# Altium schematic sheet Power Supply.SchDoc: 电动汽车电池管理系统
size A4; Address1: 先进成图技术赛道国赛试题; Address2: 陈大勇; Address3: 000000000000000000; Address4: DZ001; SheetNumber: 3; SheetTotal: 4
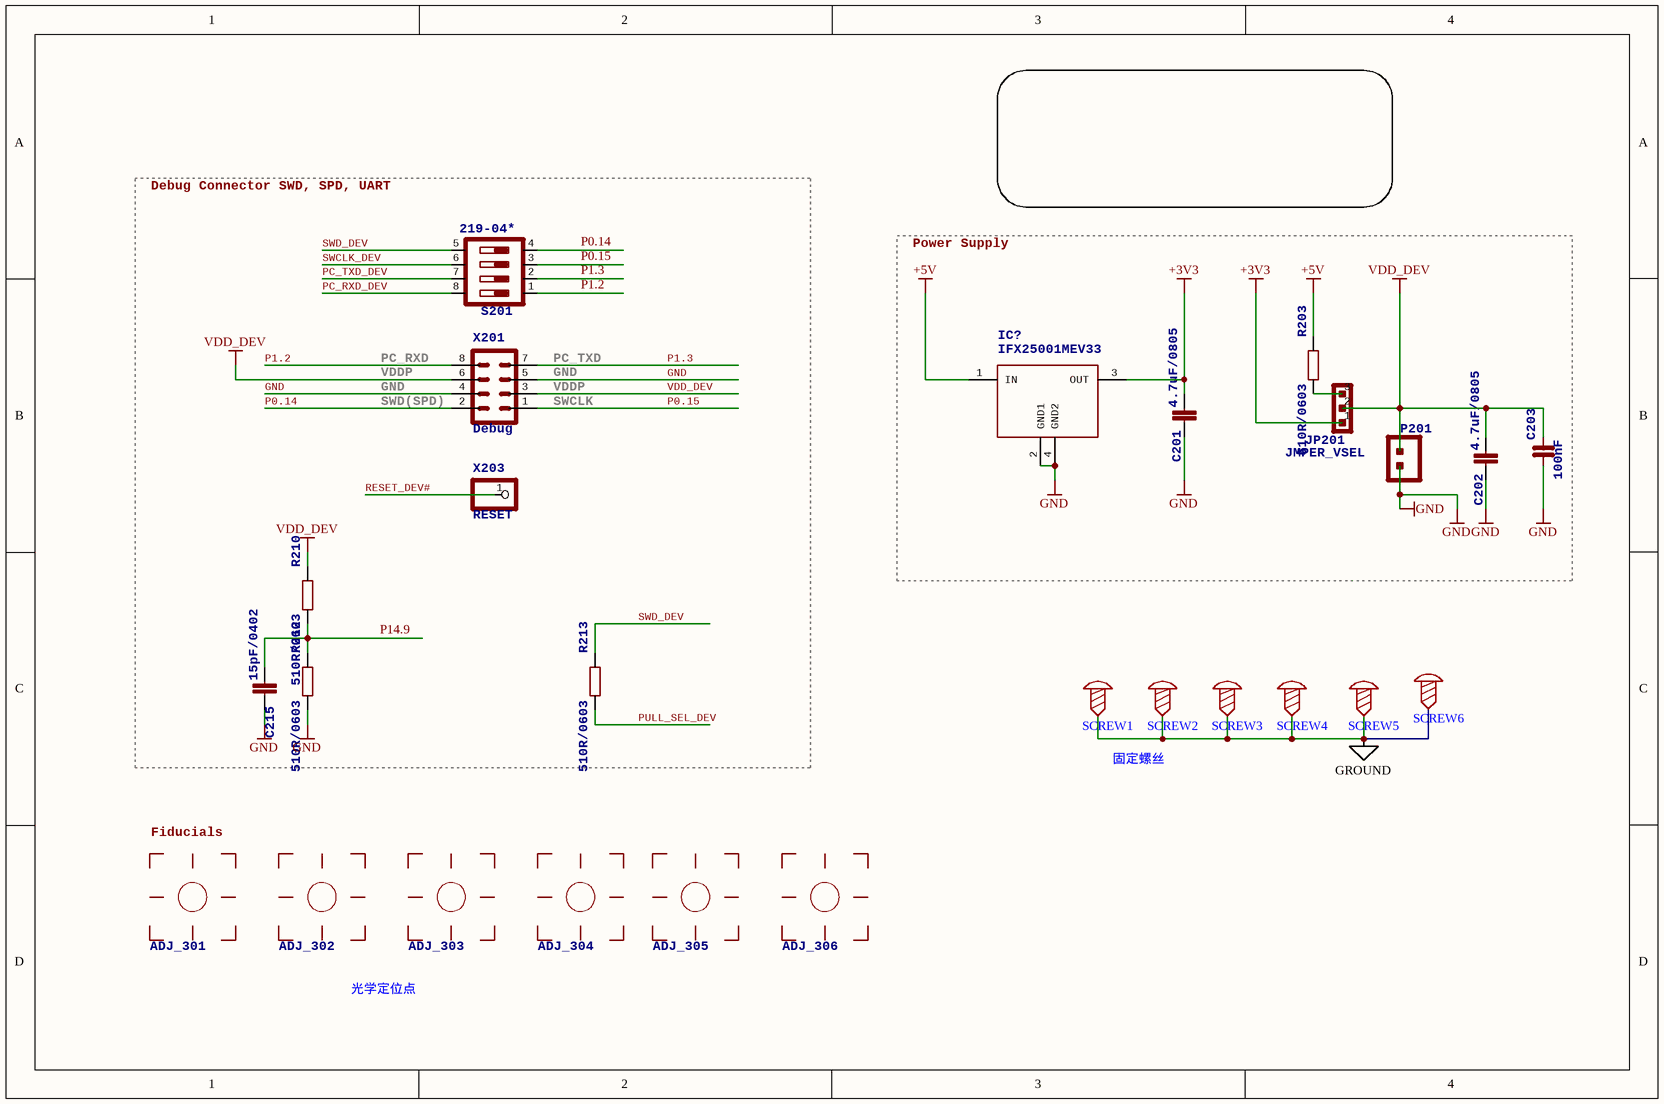
[diagram p0: Power Supply.SchDoc]

## Parts
ADJ_301  FIDUCIAL  [FIDUCIAL]  (value not drawn)
ADJ_302  FIDUCIAL  [FIDUCIAL]  (value not drawn)
ADJ_303  FIDUCIAL  [FIDUCIAL]  (value not drawn)
ADJ_304  FIDUCIAL  [FIDUCIAL]  (value not drawn)
ADJ_305  FIDUCIAL  [FIDUCIAL]  (value not drawn)
ADJ_306  FIDUCIAL  [FIDUCIAL]  (value not drawn)
C201  4.7uF/0805  [C0805K]
C202  4.7uF/0805  [C0805K]
C203  100nF  [0603]
C215  15pF/0402  [C0402]
IC?  IFX25001MEV33  [SOT223R_INFINEON]
JP201  JMPER_VSEL  [JUMPER_VSEL]
P201  SUPPLY-PADS  [SUPPLY-PADS]  (value not drawn)
R203  510R/0603  [R0603]
R210  510R/0603  [R0603]
R212  510R/0603  [R0603]
R213  510R/0603  [R0603]
S201  219-04*  [CTS-219-04]
SCREW1  1  [M3]  (value not drawn)
SCREW2  1  [M3]  (value not drawn)
SCREW3  1  [M3]  (value not drawn)
SCREW4  1  [M3]  (value not drawn)
SCREW5  1  [M3]  (value not drawn)
SCREW6  1  [M3]  (value not drawn)
X201  Debug  [MA04-2]
X203  RESET  [1X01]

## Blocks framed on the sheet
Power Supply: C201-C203 IC? JP201 P201 R203

## Nets
+3V3: C201.1 IC?.3(OUT) JP201.1
+5V: IC?.1(IN) R203.2
GND: C201.2 C202.2 C203.1 C215.2 IC?.2(GND1) IC?.4(GND2) P201.2 R212.1 X201.4 X201.5
GROUND: SCREW1.1 SCREW2.1 SCREW3.1 SCREW4.1 SCREW5.1 SCREW6.1
VDD_DEV: C202.1 C203.2 JP201.2 P201.1 R210.2 X201.3 X201.6
P0.14: S201.4 X201.2
P0.15: S201.3 X201.1
P1.2: S201.1 X201.8
P1.3: S201.2 X201.7
P14.9: C215.1 R210.1 R212.2
PC_RXD_DEV: S201.8
PC_TXD_DEV: S201.7
PULL_SEL_DEV: R213.1
RESET_DEV#: X203.1
SWCLK_DEV: S201.6
SWD_DEV: R213.2 S201.5
NetJP201_3: JP201.3 R203.1

## Notes on the sheet
- Debug Connector SWD, SPD, UART
- PC_RXD
- VDDP
- GND
- (near X201) SWD(SPD)
- PC_TXD
- (near X201) GND
- (near X201) VDDP
- (near X201) SWCLK
- 固定螺丝
- (near ADJ_301) Fiducials
- 光学定位点
- 项目名称
- 选手信息
- 当前日期
- 图页名称
- 当前时间
- 第           幅
- 共           幅

## Library data of the parts
ADJ_301-ADJ_306 = FIDUCIAL: Fiducial   FIDUCIAL: Durchmesser = 0.75mm Kupfer und 1.5mm Lötstopmaske FIDUCIAL 0.5mm: Durchmesser= 0.5mm Kupfer und 1.0mm Lötstopmaske
C201 C202 = C-EUC0805K: CAPACITOR, European symbol
C203 = CNP-0603: NON-POLARIZED CAP
C215 = C-EUC0402
R203 R210 R212 R213 = R-EU_R0603
S201 = 219-04*: Surface Mount DIP Switch Series 219 SMT   CTS Electronic Components Sourc: www.ctscorp.com
SCREW1-SCREW6 = M3螺丝: Symbol: 螺丝孔; Convert to PCB: yes; Device: M3螺丝; Add into BOM: yes; Supplier Footprint: 插件
X201 = MA04-2: PIN HEADER
X203 = PINHD-1X1: PIN HEADER